# Altium project Prj_SIM808_ArduinoNano.PrjPcb
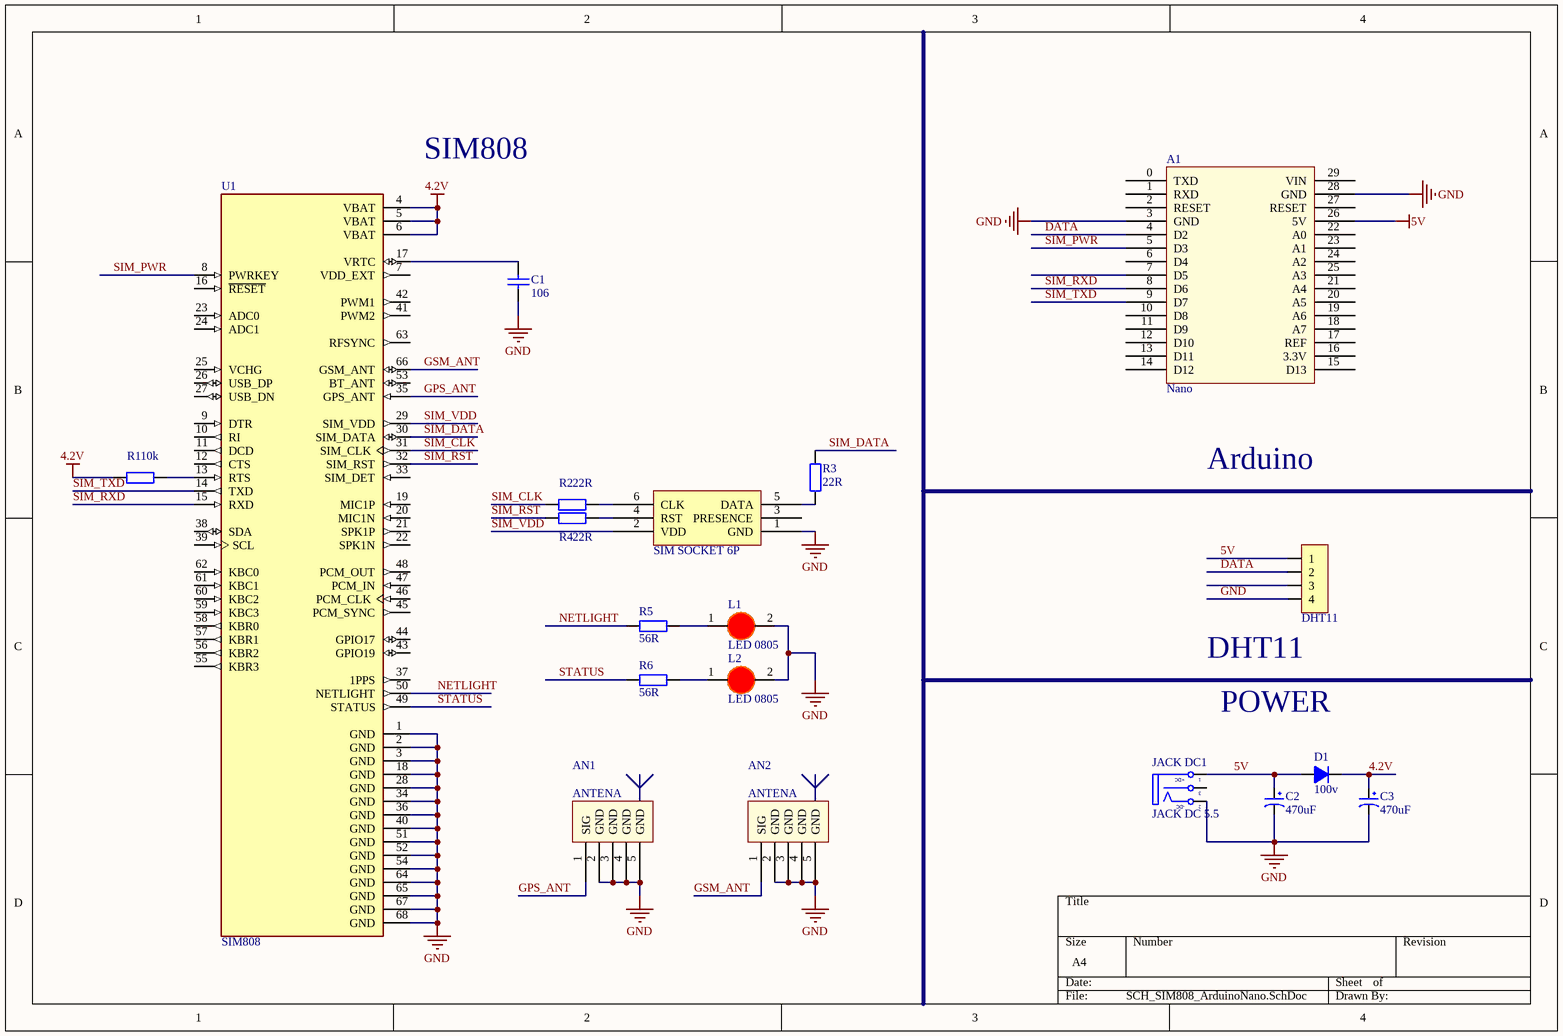
[diagram p0: SCH_SIM808_ArduinoNano.SchDoc]
1 sheet, 19 parts. Net scope: global (net labels, ports and power ports of the same name join across sheets).
Board file: PCB_SIM808_ArduinoNano.PcbDoc

## Sheet SCH_SIM808_ArduinoNano.SchDoc
size A4

### Parts
A1  Nano  [Arduino nano]
AN1  ANTENA  [DE ANTEN SMA CONG]
AN2  ANTENA  [DE ANTEN SMA CONG]
C1  106  [tu 0805]
C2  470uF  [tu tantalum smd7343]
C3  470uF  [tu tantalum smd7343]
D1  100v  [DIODE 1A]
JACK_DC1  JACK DC 5.5  [JACK DC 5.5]
JP1  DHT11  [JP 1x4 DT]
L1  LED 0805  [LED-0805-Red]
L2  LED 0805  [LED-0805-Red]
R1  10k  [tro smd 0805]
R2  22R  [tro smd 0805]
R3  22R  [tro smd 0805]
R4  22R  [tro smd 0805]
R5  56R  [tro smd 0805]
R6  56R  [tro smd 0805]
SIM1  SIM SOCKET 6P  [SIM SOCKET 6P]
U1  SIM808  [SIM808]

### Nets
4.2V: C3.1 D1.2(K) R1.1 U1.4(VBAT) U1.5(VBAT) U1.6(VBAT)
5V: A1.26(5V) C2.1 D1.1(A) JACK_DC1.1(T) JP1.1
GND: A1.3(GND) A1.28(GND) AN1.2(GND) AN1.3(GND) AN1.4(GND) AN1.5(GND) AN2.2(GND) AN2.3(GND) AN2.4(GND) AN2.5(GND) C1.2 C2.2 C3.2 JACK_DC1.2(TN) JP1.4 L1.2(K) L2.2(K) SIM1.1(GND) U1.1(GND) U1.2(GND) U1.3(GND) U1.18(GND) U1.28(GND) U1.34(GND) U1.36(GND) U1.40(GND) U1.51(GND) U1.52(GND) U1.54(GND) U1.64(GND) U1.65(GND) U1.67(GND) U1.68(GND)
DATA: A1.4(D2) JP1.2
GPS_ANT: AN1.1(SIG) U1.35(GPS_ANT)
GSM_ANT: AN2.1(SIG) U1.66(GSM_ANT)
NETLIGHT: R5.1 U1.50(NETLIGHT)
SIM_CLK: R2.1 U1.31(SIM_CLK)
SIM_DATA: R3.2 U1.30(SIM_DATA)
SIM_PWR: A1.5(D3) U1.8(PWRKEY)
SIM_RST: R4.1 U1.32(SIM_RST)
SIM_RXD: A1.8(D6) U1.15(RXD)
SIM_TXD: A1.9(D7) U1.14(TXD)
SIM_VDD: SIM1.2(VDD) U1.29(SIM_VDD)
STATUS: R6.1 U1.49(STATUS)
NetC1_1: C1.1 U1.17(VRTC)
NetL1_1: L1.1(A) R5.2
NetL2_1: L2.1(A) R6.2
NetR1_2: R1.2 U1.13(RTS)
NetR2_2: R2.2 SIM1.6(CLK)
NetR3_1: R3.1 SIM1.5(DATA)
NetR4_2: R4.2 SIM1.4(RST)

Not connected (* = marked no-connect by the designer): A1 0(TXD) 1(RXD) 2(RESET) 6(D4) 7(D5) 10(D8) 11(D9) 12(D10) 13(D11) 14(D12) 15(D13) 16(3.3V) 17(REF) 18(A7) 19(A6) 20(A5) 21(A4) 22(A0) 23(A1) 24(A2) 25(A3) 27(RESET) 29(VIN); JACK_DC1 3(S); JP1 3; SIM1 3(PRESENCE); U1 7(VDD_EXT) 9(DTR) 10(RI) 11(DCD) 12(CTS) 16(~{RESET}) 19(MIC1P) 20(MIC1N) 21(SPK1P) 22(SPK1N) 23(ADC0) 24(ADC1) 25(VCHG) 26(USB_DP) 27(USB_DN) 33(SIM_DET) 37(1PPS) 38(SDA) 39(SCL) 41(PWM2) 42(PWM1) 43(GPIO19) 44(GPIO17) 45(PCM_SYNC) 46(PCM_CLK) 47(PCM_IN) 48(PCM_OUT) 53(BT_ANT) 55(KBR3) 56(KBR2) 57(KBR1) 58(KBR0) 59(KBC3) 60(KBC2) 61(KBC1) 62(KBC0) 63(RFSYNC)

### Notes on the sheet
- SIM808
- Arduino
- (near JP1) DHT11
- POWER
- (in symbol JACK DC 5.5) +DC; -DC

### Library data of the parts
A1 = Arduino Nano
AN1 AN2 = ANTEN SMA CONG: Generic Antenna
C1 = Tu 0805 106 16V 10%: Dán; Ten_Linh_Kien: Tụ 0805 106-10uF 10% 16V; So_Chan: 2; Don_Vi: Con; Ma_Hang: MH004553; Chung_Loai: Dán; Kieu_Chan: *
C2 C3 = Tu tantalum 470uF 10V SMD7343: Dán; Don_Vi: Con; So_Chan: 2; Ten_Linh_Kien: Tụ tantalum 477A-470uF 10V SMD7343; Ma_Hang: MH001956; Chung_Loai: Dán; Kieu_Chan: *
D1 = Diode 1N4007: Cắm; Ten_Linh_Kien: Diode 1N4007 1A (DIP); Don_Vi: Con; Ma_Hang: MH001063; Ghi Chu: *; Kieu_Chan: *; Chung_Loai: Cắm
JACK_DC1 = JACK DC 5.5: Value: Jac DC
JP1 = JP 1x4 2.54 Duc Thang: Cắm; Ten_Linh_Kien: Jump Đơn Đực 2.54MM 1x40P Thẳng 11MM; Don_Vi: Con; Ma_Hang: MH000903; Ghi_Chu: *; Kieu_Chan: *; Chung_Loai: Cắm
L1 L2 = LED 0805 Do: Dán; Don_Vi: Con; Ma_Hang: MH000897; Ten_Linh_Kien: LED 0805 Màu Đỏ (Red); Ghi_Chu: *; Kieu_Chan: *; Chung_Loai: Dán
R1 = Tro 0805 5% 10k: Dán; Don_Vi: Con; So_Chan: 2; Ten_Linh_Kien: Trở 0805 5% 10k; Ma_Hang: MH005239; Chung_Loai: Dán; Kieu_Chan: *
R2-R4 = Tro 0805 5% 22R: Dán; Don_Vi: Con; So_Chan: 2; Ten_Linh_Kien: Trở 0805 5% 22R; Ma_Hang: MH005249; Chung_Loai: Dán; Kieu_Chan: *
R5 R6 = Tro 0805 5% 56R: Dán; Don_Vi: Con; So_Chan: 2; Ten_Linh_Kien: Trở 0805 5% 56R; Ma_Hang: MH005323; Chung_Loai: Dán; Kieu_Chan: *
SIM1 = SIM SOCKET 6P: Ma_Hang: MH001823; Ten_LK: Socket SIM 6P SK06
U1 = SIM808: SIM808 GPS, GPRS/GSM RF Arduino Platform Evaluation Expansion Board; MF: Adafruit Industries; MP: SIM808; Package: None; SnapEDA_Link: https://www.snapeda.com/parts/SIM808/SIMcom%20Wireless%20solutions%20Co.%2CLtd/view-part/424834/?ref=snap; Availability: Unavailable; Price: None; Value: *